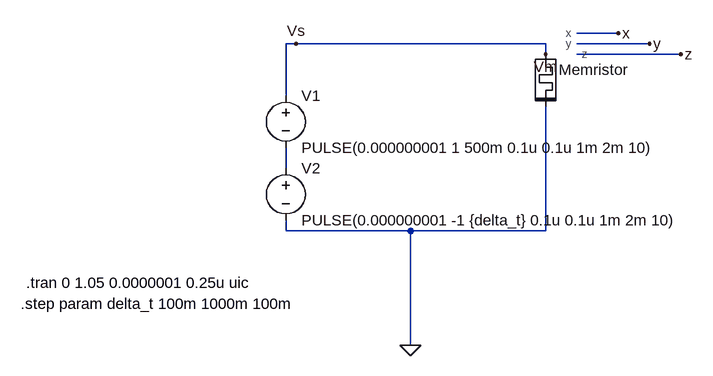
[diagram p0: schematic memristor_volRCn.asc]
memristor_volRCn.asc, the LTspice schematic file:
Version 4
SHEET 1 880 680
WIRE -1024 -608 -1088 -608
WIRE -1520 -592 -1536 -592
WIRE -1136 -592 -1520 -592
WIRE -976 -592 -1088 -592
WIRE -1136 -576 -1136 -592
WIRE -928 -576 -1088 -576
WIRE -1536 -512 -1536 -592
WIRE -1536 -400 -1536 -432
WIRE -1536 -304 -1536 -320
WIRE -1344 -304 -1536 -304
WIRE -1136 -304 -1136 -496
WIRE -1136 -304 -1344 -304
WIRE -1344 -128 -1344 -304
FLAG -1344 -128 0
FLAG -1024 -608 x
FLAG -976 -592 y
FLAG -928 -576 z
FLAG -1520 -592 Vs
FLAG -1136 -576 Vm
SYMBOL memristor_vol -1152 -592 R0
SYMATTR InstName Memristor
SYMBOL voltage -1536 -528 R0
WINDOW 123 0 0 Left 0
WINDOW 39 0 0 Left 0
SYMATTR InstName V1
SYMATTR Value PULSE(0.000000001 1 500m 0.1u 0.1u 1m 2m 10)
SYMBOL voltage -1536 -416 R0
WINDOW 123 0 0 Left 0
WINDOW 39 0 0 Left 0
SYMATTR InstName V2
SYMATTR Value PULSE(0.000000001 -1 {delta_t} 0.1u 0.1u 1m 2m 10)
TEXT -1936 -224 Left 2 !.tran 0 1.05 0.0000001 0.25u uic
TEXT -1944 -192 Left 2 !.step param delta_t 100m 1000m 100m

The netlist it stands for:
* memristor_volRCn.asc
XMemristor Vm 0 x y z memristor_vol1  ; pins plus minus x y z
V1 Vm N001 PULSE(0.000000001 1 500m 0.1u 0.1u 1m 2m 10)
V2 N001 0 PULSE(0.000000001 -1 {delta_t} 0.1u 0.1u 1m 2m 10)
.tran 0 1.05 0.0000001 0.25u uic
.step param delta_t 100m 1000m 100m
.lib memristor_vol1.sub
.backanno
.end